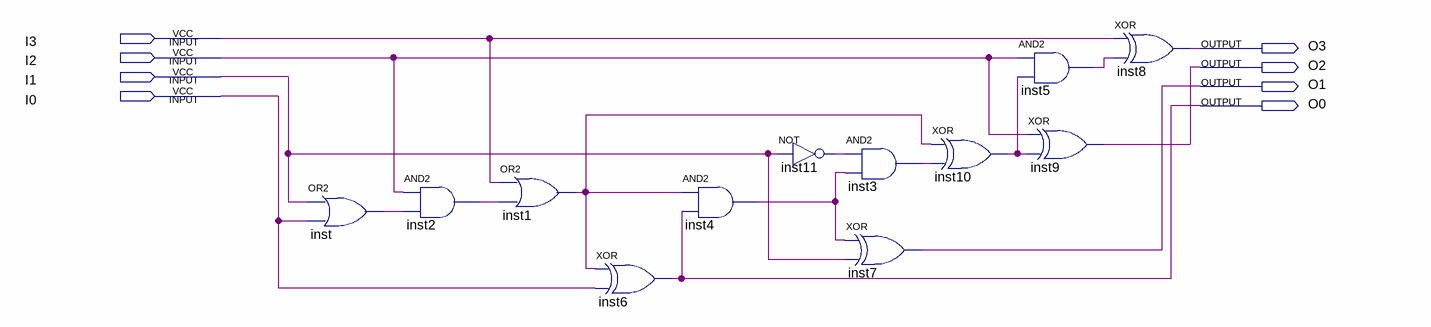
[diagram p0: schematic sheet]
// Quartus schematic Dabble.bdf as structural Verilog: 12 symbols, 8 pins
module Dabble (
  input  I3,
  input  I2,
  input  I1,
  input  I0,
  output O3,
  output O2,
  output O1,
  output O0
);

  wire inst1_out, inst2_out, inst3_out, inst4_out, inst5_out, inst10_out, inst11_out, inst_out;

  or inst (inst_out, I1, I0);
  and inst2 (inst2_out, I2, inst_out);
  or inst1 (inst1_out, I3, inst2_out);
  xor inst6 (O0, inst1_out, I0);
  and inst4 (inst4_out, inst1_out, O0);
  not inst11 (inst11_out, I1);
  and inst3 (inst3_out, inst11_out, inst4_out);
  xor inst7 (O1, inst4_out, I1);
  xor inst10 (inst10_out, inst1_out, inst3_out);
  and inst5 (inst5_out, I2, inst10_out);
  xor inst9 (O2, I2, inst10_out);
  xor inst8 (O3, I3, inst5_out);
endmodule
